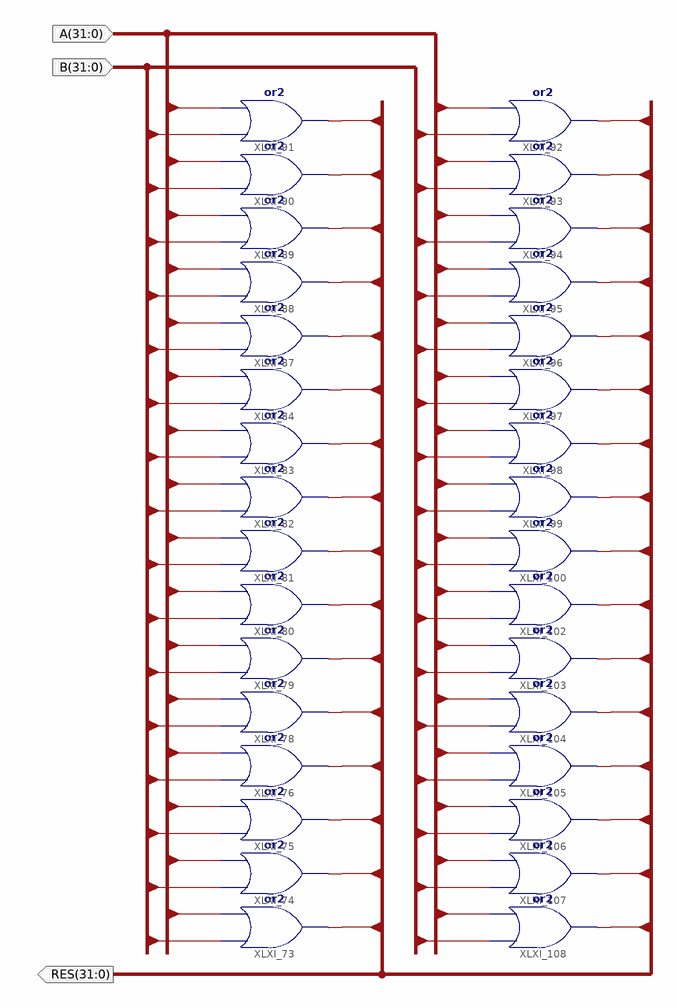
[diagram p0: schematic sheet 1]
// Xilinx ISE schematic op_or32bit.sch (spartan3e) as structural Verilog: 32 symbols, 3 ports
module op_or32bit (
  input  [31:0] B,
  input  [31:0] A,
  output [31:0] RES
);

  or XLXI_73 (RES[16], B[16], A[16]);
  or XLXI_74 (RES[17], B[17], A[17]);
  or XLXI_75 (RES[18], B[18], A[18]);
  or XLXI_76 (RES[19], B[19], A[19]);
  or XLXI_78 (RES[20], B[20], A[20]);
  or XLXI_79 (RES[21], B[21], A[21]);
  or XLXI_80 (RES[22], B[22], A[22]);
  or XLXI_81 (RES[23], B[23], A[23]);
  or XLXI_82 (RES[24], B[24], A[24]);
  or XLXI_83 (RES[25], B[25], A[25]);
  or XLXI_84 (RES[26], B[26], A[26]);
  or XLXI_87 (RES[27], B[27], A[27]);
  or XLXI_88 (RES[28], B[28], A[28]);
  or XLXI_89 (RES[29], B[29], A[29]);
  or XLXI_90 (RES[30], B[30], A[30]);
  or XLXI_91 (RES[31], B[31], A[31]);
  or XLXI_92 (RES[15], B[15], A[15]);
  or XLXI_93 (RES[14], B[14], A[14]);
  or XLXI_94 (RES[13], B[13], A[13]);
  or XLXI_95 (RES[12], B[12], A[12]);
  or XLXI_96 (RES[11], B[11], A[11]);
  or XLXI_97 (RES[10], B[10], A[10]);
  or XLXI_98 (RES[9], B[9], A[9]);
  or XLXI_99 (RES[8], B[8], A[8]);
  or XLXI_100 (RES[7], B[7], A[7]);
  or XLXI_102 (RES[6], B[6], A[6]);
  or XLXI_103 (RES[5], B[5], A[5]);
  or XLXI_104 (RES[4], B[4], A[4]);
  or XLXI_105 (RES[3], B[3], A[3]);
  or XLXI_106 (RES[2], B[2], A[2]);
  or XLXI_107 (RES[1], B[1], A[1]);
  or XLXI_108 (RES[0], B[0], A[0]);
endmodule
